# EAGLE design W5500_Tessera_002 (EAGLE 6.5.0)
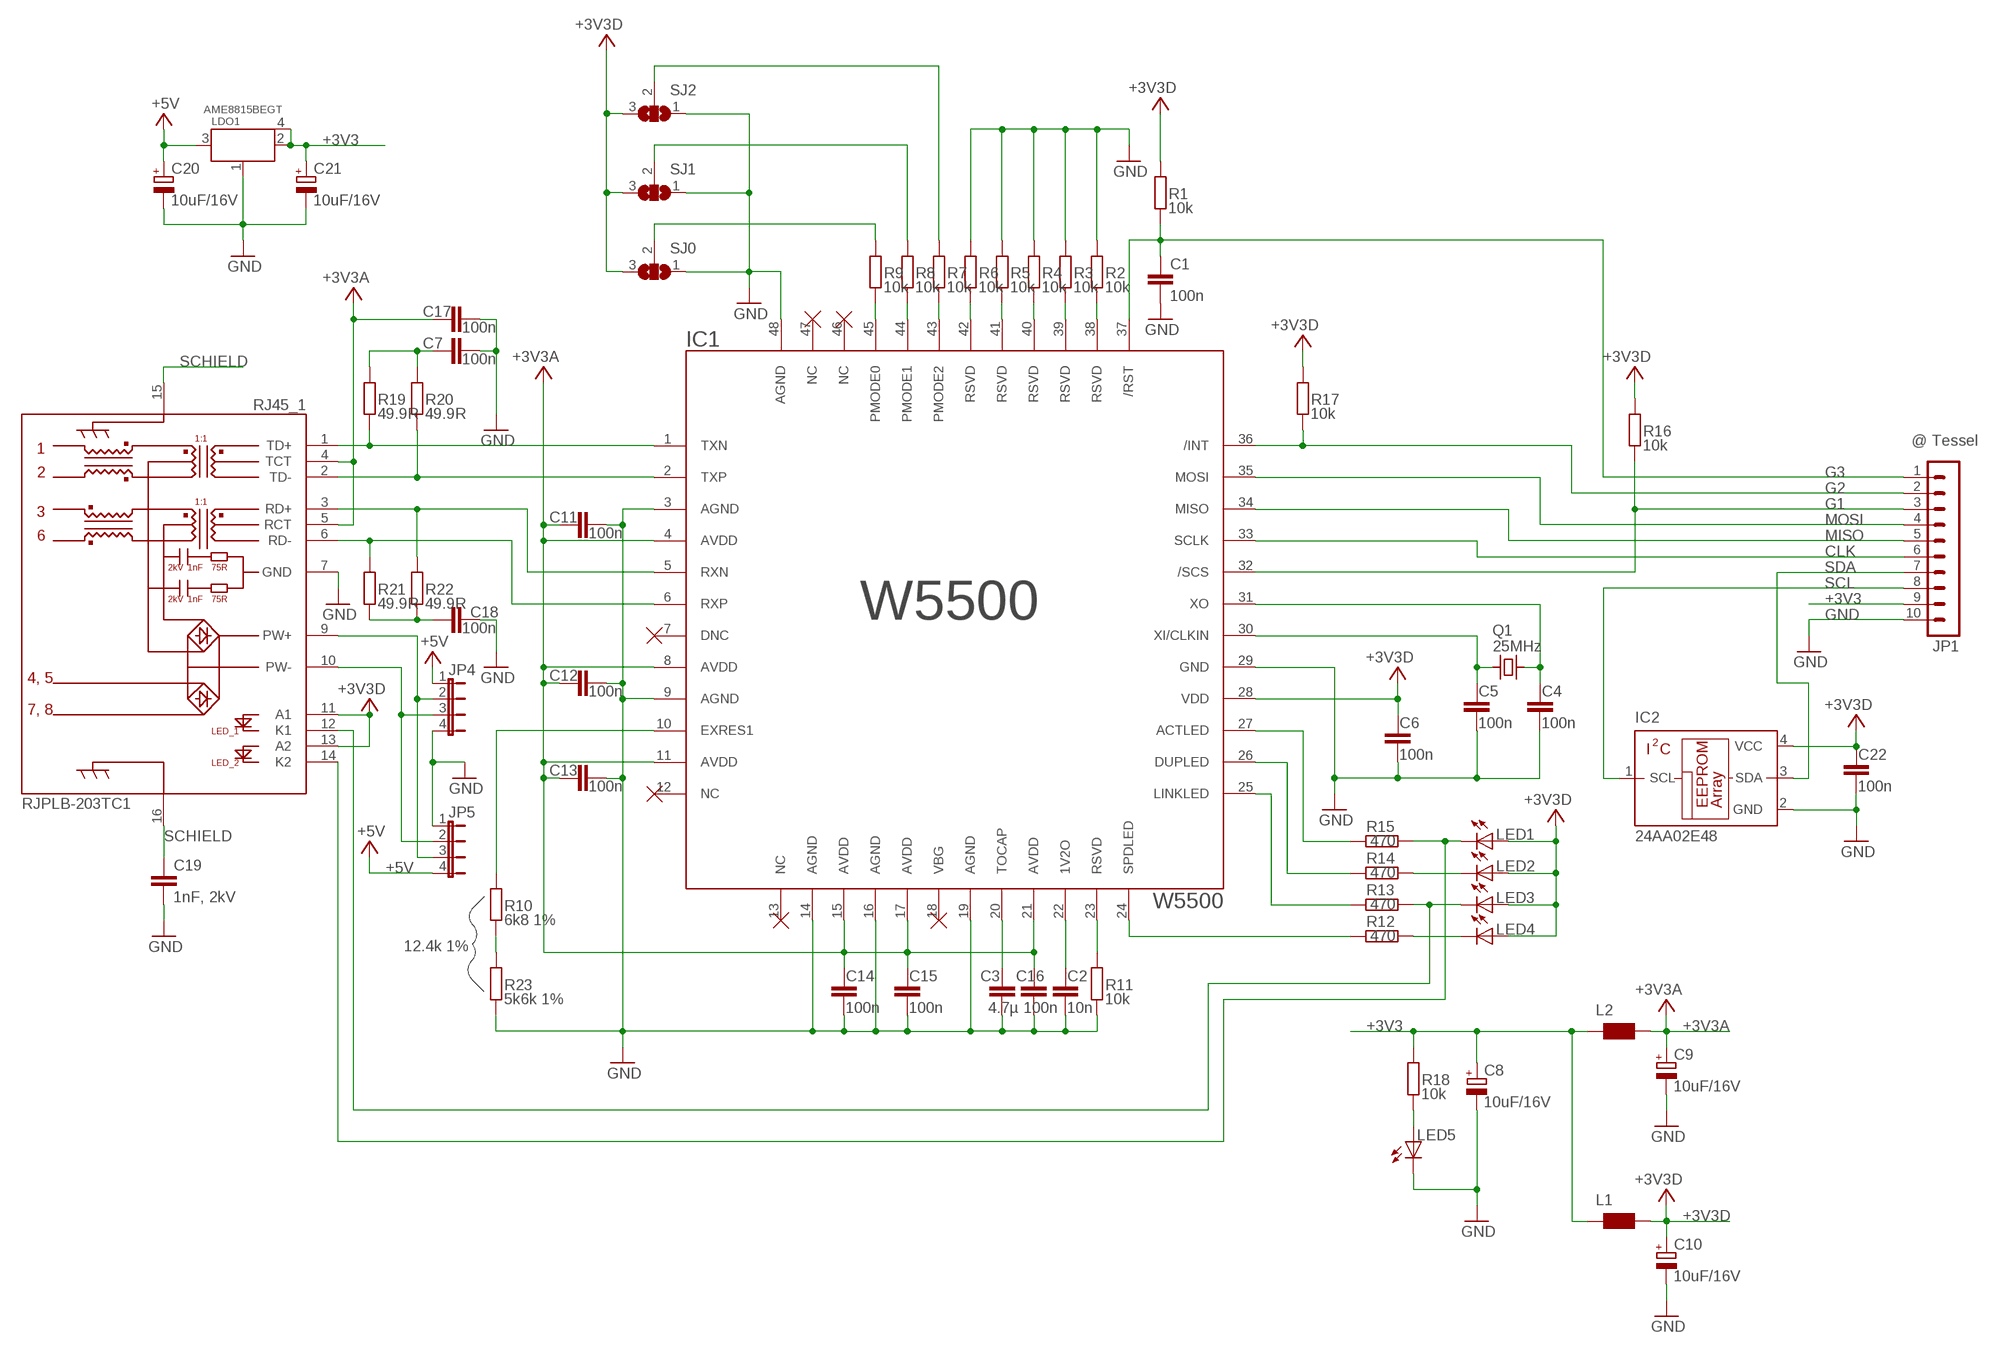
[diagram p0: schematic, sheet 1]

## Parts
C1  100n  C-EUC0603K  [C0603K]
C2  10n  C-EUC0402K  [C0402K]
C3  4.7µ  C-EUC2012  [C2012]
C4  100n  C-EUC0402K  [C0402K]
C5  100n  C-EUC0402K  [C0402K]
C6  100n  C-EUC0402K  [C0402K]
C7  100n  C-EUC0402K  [C0402K]
C8  10uF/16V  CPOL-EUA/3216-18W  [A/3216-18W]
C9  10uF/16V  CPOL-EUA/3216-18W  [A/3216-18W]
C10  10uF/16V  CPOL-EUA/3216-18W  [A/3216-18W]
C11  100n  C-EUC0402K  [C0402K]
C12  100n  C-EUC0402K  [C0402K]
C13  100n  C-EUC0402K  [C0402K]
C14  100n  C-EUC0402K  [C0402K]
C15  100n  C-EUC0402K  [C0402K]
C16  100n  C-EUC0402K  [C0402K]
C17  100n  C-EUC0402K  [C0402K]
C18  100n  C-EUC0402K  [C0402K]
C19  1nF, 2kV  C-EUC3216  [C3216]
C20  10uF/16V  CPOL-EUA/3216-18W  [A/3216-18W]
C21  10uF/16V  CPOL-EUA/3216-18W  [A/3216-18W]
C22  100n  C-EUC0402K  [C0402K]
IC1  W5500  [LQFP48]
IC2  24AA02E48  24AA00OT  [SOT23-5L]
JP1  @ Tessel  MA10-1  [MA10-1]
JP4  JP4E  [JP4]
JP5  JP4E  [JP4]
L1  WE-CBF_0603  [0603]
L2  WE-CBF_0603  [0603]
LDO1  AME8815BEGT  [SOT223]
LED1  LEDCHIPLED_0603  [CHIPLED_0603]
LED2  LEDCHIPLED_0603  [CHIPLED_0603]
LED3  LEDCHIPLED_0603  [CHIPLED_0603]
LED4  LEDCHIPLED_0603  [CHIPLED_0603]
LED5  LEDCHIPLED_0603  [CHIPLED_0603]
Q1  25MHz  SMD02502-4  [SMD02502-4]
R1  10k  R-EU_R0402  [R0402]
R2  10k  R-EU_R0402  [R0402]
R3  10k  R-EU_R0402  [R0402]
R4  10k  R-EU_R0402  [R0402]
R5  10k  R-EU_R0402  [R0402]
R6  10k  R-EU_R0402  [R0402]
R7  10k  R-EU_R0402  [R0402]
R8  10k  R-EU_R0402  [R0402]
R9  10k  R-EU_R0402  [R0402]
R10  6k8 1%  R-EU_R0402  [R0402]
R11  10k  R-EU_R0402  [R0402]
R12  470  R-EU_R0402  [R0402]
R13  470  R-EU_R0402  [R0402]
R14  470  R-EU_R0402  [R0402]
R15  470  R-EU_R0402  [R0402]
R16  10k  R-EU_R0402  [R0402]
R17  10k  R-EU_R0402  [R0402]
R18  10k  R-EU_R0402  [R0402]
R19  49.9R  R-EU_R0402  [R0402]
R20  49.9R  R-EU_R0402  [R0402]
R21  49.9R  R-EU_R0402  [R0402]
R22  49.9R  R-EU_R0402  [R0402]
R23  5k6k 1%  R-EU_R0402  [R0402]
RJ45_1  RJPLB-203TC1  [RJPLB-203]
SJ0  SJ2W  [SJ_2]
SJ1  SJ2W  [SJ_2]
SJ2  SJ2W  [SJ_2]

## Nets
+3V3: C8.+ C21.+ JP1.9 L1.2 L2.2 LDO1.2 LDO1.4 R18.2 RJ45_1.11(A1) RJ45_1.13(A2) ; supply symbol labelled +3V3D
+3V3A: C9.+ C11.1 C12.1 C13.1 C14.1 C15.1 C16.1 C17.1 IC1.4(AVDD) IC1.8(AVDD) IC1.11(AVDD) IC1.15(AVDD) IC1.17(AVDD) IC1.21(AVDD) L2.1 RJ45_1.4(TCT) RJ45_1.5(RCT)
+3V3D: C6.1 C10.+ C22.1 IC1.28(VDD) IC2.4(VCC) L1.1 LED1.A LED2.A LED3.A LED4.A R1.2 R16.2 R17.2 SJ0.3 SJ1.3 SJ2.3
+5V: C20.+ JP4.1 JP5.4 LDO1.3
ACTLED: IC1.27(ACTLED) R15.1
CLK: IC1.33(SCLK) JP1.6
G1: IC1.32(/SCS) JP1.3 R16.1
G2: IC1.36(/INT) JP1.2 R17.1
G3: C1.1 IC1.37(/RST) JP1.1 R1.1
GND: C1.2 C2.2 C3.2 C4.2 C5.2 C6.2 C7.2 C8.- C9.- C10.- C11.2 C12.2 C13.2 C14.2 C15.2 C16.2 C17.2 C18.2 C19.2 C20.- C21.- C22.2 IC1.3(AGND) IC1.9(AGND) IC1.14(AGND) IC1.16(AGND) IC1.19(AGND) IC1.29(GND) IC1.48(AGND) IC2.2(GND) JP1.10 JP4.4 JP5.1 LDO1.1 LED5.C R2.2 R3.2 R4.2 R5.2 R6.2 R11.1 R23.1 RJ45_1.7(GND) SJ0.1 SJ1.1 SJ2.1
MISO: IC1.34(MISO) JP1.5
MOSI: IC1.35(MOSI) JP1.4
N$4: IC1.25(LINKLED) R13.1
N$5: R10.1 R23.2
N$9: IC1.23(RSVD) R11.2
N$10: IC1.38(RSVD) R2.1
N$11: IC1.39(RSVD) R3.1
N$12: IC1.40(RSVD) R4.1
N$13: IC1.41(RSVD) R5.1
N$14: IC1.42(RSVD) R6.1
N$15: IC1.43(PMODE2) R7.1
N$16: IC1.44(PMODE1) R8.1
N$17: IC1.45(PMODE0) R9.1
N$18: R9.2 SJ0.2
N$19: R8.2 SJ1.2
N$20: R7.2 SJ2.2
N$22: IC1.10(EXRES1) R10.2
N$23: C2.1 IC1.22(1V2O)
N$24: C3.1 IC1.20(TOCAP)
N$25: IC1.24(SPDLED) R12.1
N$26: IC1.26(DUPLED) R14.1
N$28: LED4.C R12.2
N$29: LED3.C R13.2 RJ45_1.12(K1)
N$30: LED2.C R14.2
N$31: LED1.C R15.2 RJ45_1.14(K2)
N$32: C4.1 IC1.31(XO) Q1.3
N$33: C5.1 IC1.30(XI/CLKIN) Q1.1
N$34: LED5.A R18.1
N$35: C7.1 R19.2 R20.2
N$36: C18.1 R21.1 R22.1
POE+: JP4.2 JP5.3 RJ45_1.9(PW+)
POE-: JP4.3 JP5.2 RJ45_1.10(PW-)
RXN: IC1.6(RXP) R21.2 RJ45_1.6(RD-)
RXP: IC1.5(RXN) R22.2 RJ45_1.3(RD+)
SCHIELD: C19.1 RJ45_1.15(SCHIELD_1) RJ45_1.16(SCHIELD_2)
SCL: IC2.1(SCL) JP1.8
SDA: IC2.3(SDA) JP1.7
TXN: IC1.2(TXP) R20.1 RJ45_1.2(TD-)
TXP: IC1.1(TXN) R19.1 RJ45_1.1(TD+)
Unconnected: IC1.7(DNC) IC1.12(NC) IC1.13(NC) IC1.18(VBG) IC1.46(NC) IC1.47(NC)

## Notes on the sheet
- W5500
- 12.4k 1%

## Library data of the parts
C1-C7 C11-C19 C22 = resistor:C-EU: CAPACITOR, European symbol
C8-C10 C20 C21 = resistor:CPOL-EU: POLARIZED CAPACITOR, European symbol
IC1 = _wiznet_2013-08-18:W5500: W5500: WIZnet Hardwired TCP/IP + MAC + PHY - Internet Interface Chip
IC2 = microchip:24*00: Serial EEPROM 128 bit, I2C (AA = 1.8 V/LC = 2.5 V/C = 5.0 V); MF: MICROCHIP; MPN: 24AA00T-I/OTG; OC_FARNELL: 1331264; OC_NEWARK: 89H3038
JP1 = con-lstb:MA10-1: PIN HEADER; OC_FARNELL: unknown; OC_NEWARK: unknown
JP4 JP5 = jumper:JP4E: JUMPER
L1 L2 = wuerth-elektronik:WE-CBF: SMD EMI Suppression Ferrite Beads - excellent anti-EMI properties - low DCR - impedances till 3000 ohms - rated current up to 6 A
LDO1 = _wiznet_2013-08-18:AME8815BEGT
LED1-LED5 = led:LED: LED OSRAM: - CHIPLED LG R971, LG N971, LY N971, LG Q971, LY Q971, LO R971, LY R971 LH N974, LH R974 LS Q976, LO Q976, LY Q976 LO Q996 - Hyper CHIPLED LW Q18S LB Q993, LB Q99A, LB R99A - SideLED LS A670, LO A670, LY A670, LG A670, LP A670 LB A673, LV A673, LT A673, LW A673 LH A674 LY A675 LS A676, LA A676, LO A676, LY A676, LW A676 LS A679, LY A679, LG A679 - Hyper Micro SIDELED® LS Y876, LA Y876, LO Y876, LY Y876 LT Y87S - SmartLED LW L88C, LW L88S LB L89C, LB L89S, LG L890 LS L89K, LO L89K, LY L89K LS L896, LA L896, LO L896, LY L896 - TOPLED LS T670, LO T670, LY T670, LG T670, LP T670 LSG T670, LSP T670, LSY T670, LOP T670, LYG T670 LG T671, LOG T671, LSG T671 LB T673, LV T673, LT T673, LW T673 LH T674 LS T676, LA T676, LO T676, LY T676, LB T676, LH T676, LSB T676, LW T676 LB T67C, LV T67C, LT T67C, LS T67K, LO T67K, LY T67K, LW E67C LS E67B, LA E67B, LO E67B, LY E67B, LB E67C, LV E67C, LT E67C LW T67C LS T679, LY T679, LG T679 LS T770, LO T770, LY T770, LG T770, LP T770 LB T773, LV T773, LT T773, LW T773 LH T774 LS E675, LA E675, LY E675, LS T675 LS T776, LA T776, LO T776, LY T776, LB T776 LHGB T686 LT T68C, LB T68C - Hyper Mini TOPLED® LB M676 - Mini TOPLED Santana® LG M470 LS M47K, LO M47K, LY M47K Source: http://www.osram.convergy.de LUXEON: - LUMILED® LXK2-PW12-R00, LXK2-PW12-S00, LXK2-PW14-U00, LXK2-PW14-V00 LXK2-PM12-R00, LXK2-PM12-S00, LXK2-PM14-U00 LXK2-PE12-Q00, LXK2-PE12-R00, LXK2-PE12-S00, LXK2-PE14-T00, LXK2-PE14-U00 LXK2-PB12-K00, LXK2-PB12-L00, LXK2-PB12-M00, LXK2-PB14-N00, LXK2-PB14-P00, LXK2-PB14-Q00 LXK2-PR12-L00, LXK2-PR12-M00, LXK2-PR14-Q00, LXK2-PR14-R00 LXK2-PD12-Q00, LXK2-PD12-R00, LXK2-PD12-S00 LXK2-PH12-R00, LXK2-PH12-S00 LXK2-PL12-P00, LXK2-PL12-Q00, LXK2-PL12-R00 Source: www.luxeon.com KINGBRIGHT: KA-3528ASYC Source: www.kingbright.com
Q1 = Petermann_5_11_0:SMD02502-4
R1-R23 = resistor:R-EU_: RESISTOR, European symbol
RJ45_1 = Taimag:RJPLB-203TC1
SJ0 SJ1 SJ2 = jumper:SJ2W: SMD solder JUMPER

## Board
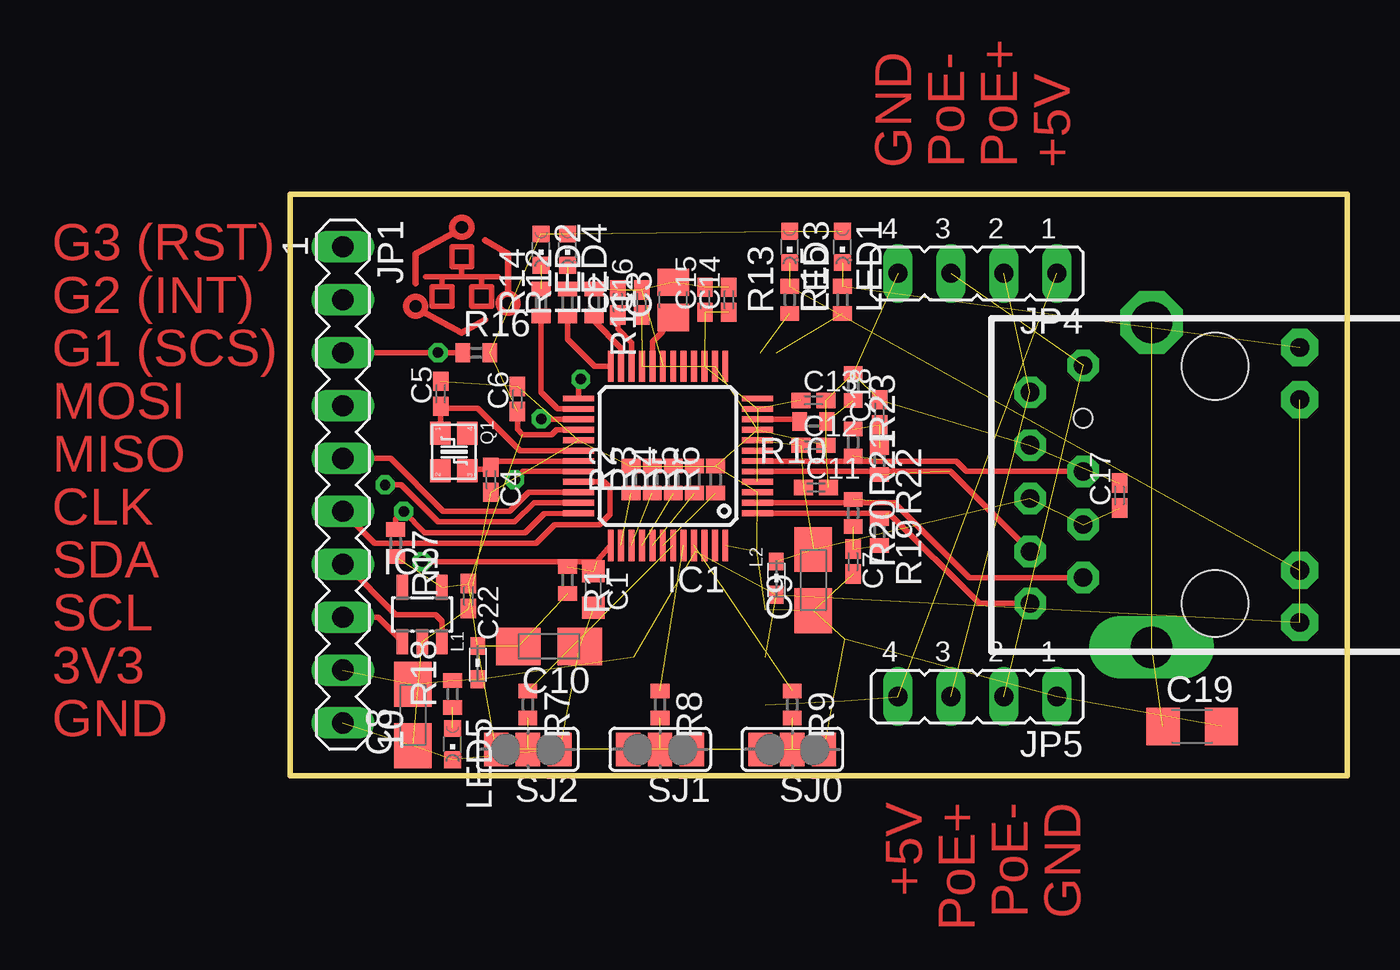
[diagram p1: board, top side]
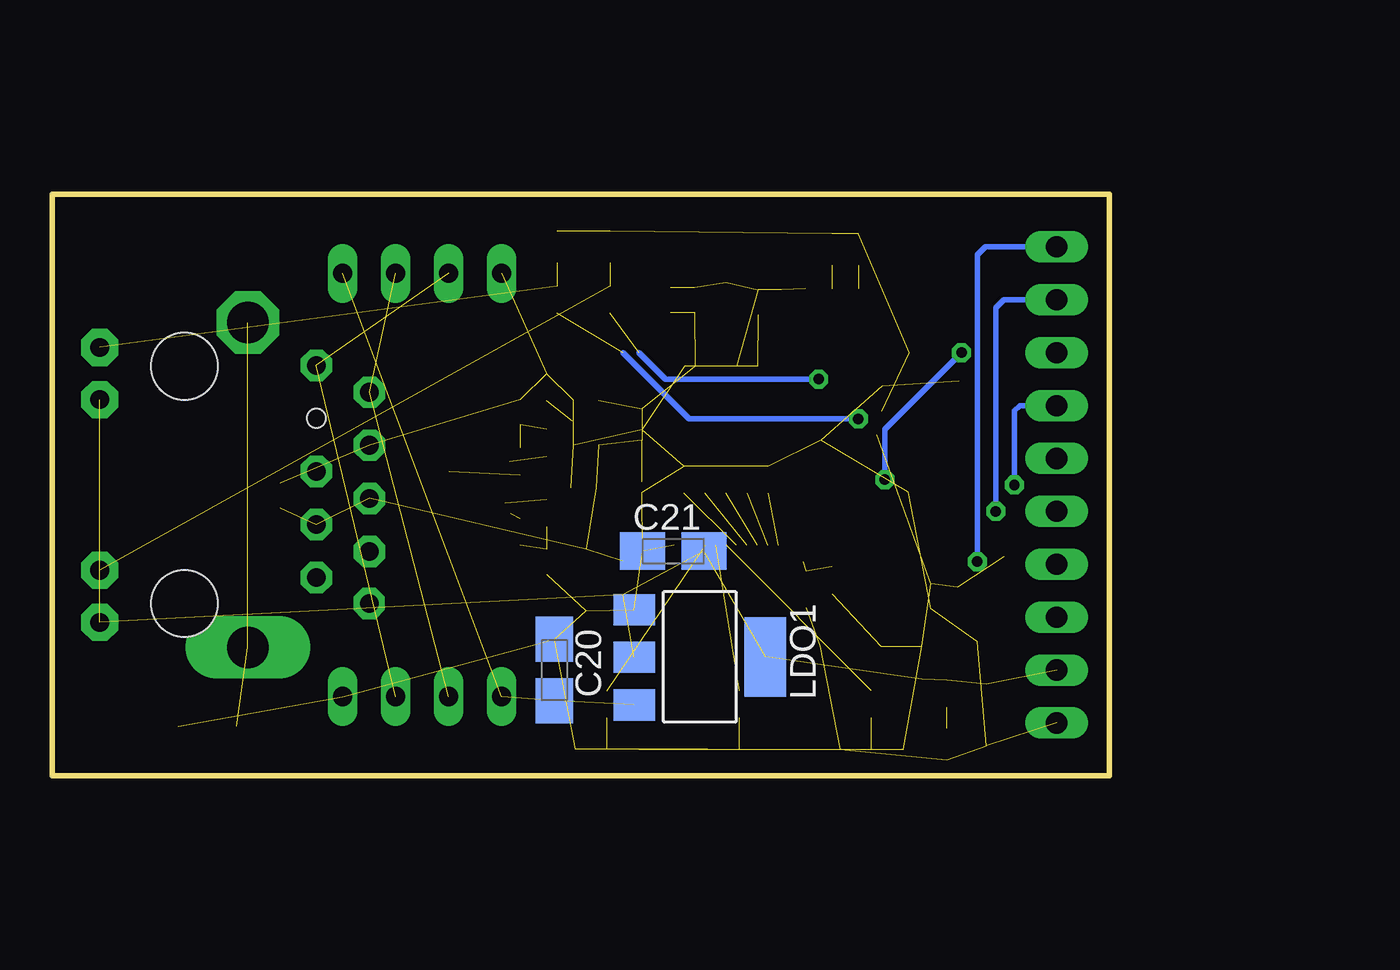
[diagram p2: board, bottom side, seen from below]

Size 50.8 x 27.94 mm. Coordinates in mm from the lower left corner, seen from the top.
Outline: 0,0 50.8,0 50.8,27.94 0,27.93 0,0
Copper layers (1*16): Top 0.035mm / dielectric 1.5mm / Bottom 0.035mm
Design rules "default": minimum track width 10mil, minimum drill 24mil, track to track 8mil, track to pad 8mil, pad to pad 8mil, via to via 8mil, smd to smd 8mil, copper to edge 40mil, drill to drill 8mil, minimum pad ring 10mil, minimum via ring 8mil, stop-mask expansion 4mil, vias tented up to drill 0mil, thermal gap 10mil

### Footprints (pad centres in the part's own frame; a part is rotated, then mirrored left to right if it is on the bottom)
C0603K = smd 1.05 x 1.08: 1 -0.875,0; 2 0.875,0
C0402K = smd 0.925 x 0.74: 1 -0.6,0; 2 0.6,0
C2012 = smd 1.3 x 1.5: 1 -0.85,0; 2 0.85,0
A/3216-18W = smd 2.15 x 1.8: + 1.475,0; - -1.475,0
C3216 = smd 1.6 x 1.8: 1 -1.4,0; 2 1.4,0
LQFP48 = smd 1.5 x 0.28: 1 -4.3,2.75; 2 -4.3,2.25; 3 -4.3,1.75; 4 -4.3,1.25; 5 -4.3,0.75; 6 -4.3,0.25; 7 -4.3,-0.25; 8 -4.3,-0.75; 9 -4.3,-1.25; 10 -4.3,-1.75; 11 -4.3,-2.25; 12 -4.3,-2.75; 25 4.3,-2.75; 26 4.3,-2.25; 27 4.3,-1.75; 28 4.3,-1.25; 29 4.3,-0.75; 30 4.3,-0.25; 31 4.3,0.25; 32 4.3,0.75; 33 4.3,1.25; 34 4.3,1.75; 35 4.3,2.25; 36 4.3,2.75 | smd 0.28 x 1.5: 13 -2.75,-4.3; 14 -2.25,-4.3; 15 -1.75,-4.3; 16 -1.25,-4.3; 17 -0.75,-4.3; 18 -0.25,-4.3; 19 0.25,-4.3; 20 0.75,-4.3; 21 1.25,-4.3; 22 1.75,-4.3; 23 2.25,-4.3; 24 2.75,-4.3; 37 2.75,4.3; 38 2.25,4.3; 39 1.75,4.3; 40 1.25,4.3; 41 0.75,4.3; 42 0.25,4.3; 43 -0.25,4.3; 44 -0.75,4.3; 45 -1.25,4.3; 46 -1.75,4.3; 47 -2.25,4.3; 48 -2.75,4.3
SOT23-5L = smd 0.55 x 1.2: 1 -0.95,-1.3; 2 0,-1.3; 3 0.95,-1.3; 4 0.95,1.3; 5 -0.95,1.3
MA10-1 = drill 1.016 long: 1 -11.43,0; 2 -8.89,0; 3 -6.35,0; 4 -3.81,0; 5 -1.27,0; 6 1.27,0; 7 3.81,0; 8 6.35,0; 9 8.89,0; 10 11.43,0
JP4 = drill 0.914 long: 1 -3.81,0; 2 -1.27,0; 3 1.27,0; 4 3.81,0
0603 = smd 0.85 x 0.7: 1 -0.9,0; 2 0.7,0
SOT223 = smd 1.499 x 2.007: 1 -2.261,-3.15; 2 0.025,-3.15; 3 2.311,-3.15 | smd 3.81 x 2.007: 4 0,3.15
CHIPLED_0603 = smd 0.8 x 0.8: A 0,-0.75; C 0,0.75
SMD02502-4 = smd 1.1 x 1: 1 -0.9,-0.65; 2 0.9,-0.65; 3 0.9,0.65; 4 -0.9,0.65
R0402 = smd 0.7 x 0.9: 1 -0.65,0; 2 0.65,0
RJPLB-203 = drill 0.9 pad 1.5 octagon: 1 -5.69,8.888; 2 -4.45,6.348; 3 -3.2,8.898; 4 -1.9,6.348; 5 -0.65,8.898; 6 0.65,6.348; 7 1.9,8.898; 9 4.45,8.898; 10 5.74,6.348 | drill 0.9 pad 1.778 octagon: 11 -6.6,-4.062; 12 -4.1,-4.062; 13 4.1,-4.062; 14 6.6,-4.062 | drill 2 pad 2.2 long: 15 -7.8,3.058 | drill 2 pad 3 octagon: 16 7.8,3.058 | hole 3.2: 5.7,0.008; -5.7,0.008 | hole 0.9: 3.2,6.35
SJ_2 = smd 1.168 x 1.6: 1 -1.524,0; 2 0,0; 3 1.524,0

### Placement (x,y rotation side)
C1  14.57,8.95 270 top
C2  15.75,22.73 90 top
C3  18.41,22.86 90 top
C4  9.65,14.22 270 top
C5  7.24,18.35 90 top
C6  10.92,18.1 90 top
C7  27.05,10.29 270 top
C8  5.91,2.92 90 top
C9  25.15,9.4 90 top
C10  12.45,6.22 180 top
C11  25.27,13.84 0 top
C12  25.15,15.88 0 top
C13  25.15,18.03 0 top
C14  21.08,22.86 90 top
C15  19.94,22.86 90 top
C16  16.89,22.73 90 top
C17  39.85,13.46 90 top
C18  28.32,17.46 90 top
C19  43.34,2.38 0 top
C20  26.67,5.08 270 bottom
C21  20.95,10.79 0 bottom
C22  8.57,8.64 270 top
IC1  18.16,15.37 180 top
IC2  6.35,7.75 0 top
JP1  2.54,13.97 270 top
JP4  33.02,24.13 180 top
JP5  33.02,3.81 180 top
L1  9.02,5.33 270 top
L2  23.37,9.4 270 top
LDO1  19.68,5.71 270 bottom
LED1  26.54,25.4 180 top
LED2  12.06,25.27 180 top
LED3  24,25.4 180 top
LED4  13.34,25.27 180 top
LED5  7.81,1.52 180 top
Q1  7.87,15.56 270 top
R1  13.34,9.4 270 top
R2  16.38,14.22 90 top
R3  17.4,14.22 90 top
R4  18.41,14.22 90 top
R5  19.43,14.22 90 top
R6  20.45,14.22 90 top
R7  11.43,3.43 270 top
R8  17.78,3.43 270 top
R9  24.13,3.43 270 top
R10  25.15,17.02 180 top
R11  14.61,22.73 270 top
R12  13.34,22.73 90 top
R13  24,22.86 90 top
R14  12.06,22.73 90 top
R15  26.54,22.86 90 top
R16  8.95,20.32 0 top
R17  5.08,11.18 270 top
R18  7.81,3.94 90 top
R19  28.32,11.72 270 top
R20  27.05,12.62 270 top
R21  27.05,16 270 top
R22  28.32,15.11 270 top
R23  27.05,18.67 270 top
RJ45_1  44.45,13.97 90 top
SJ0  24.13,1.27 180 top
SJ1  17.78,1.27 180 top
SJ2  11.43,1.27 180 top

### Tracks (layer width: path | path; a pad name or v marks a point on that pad's centre or on a via)
+3V3  (9 unrouted)
+3V3A  (16 unrouted)
+3V3D  (14 unrouted)
  Top 0.254: IC1.28 12.81,16.62 12.57,16.38 11.18,16.38 10.92,16.64 C6.1
+5V  (3 unrouted)
ACTLED  (via drill 0.5 pad 0.25)  (1 unrouted)
  Top 0.254: IC1.27 12.09,17.12 v12.06,17.14
  Bottom 0.254: v12.06,17.14 20.19,17.14 23.37,20.32
CLK
  Top 0.254: IC1.33 15.09,14.12 15.37,13.84 15.37,12.57 14.86,12.06 12.7,12.06 11.81,11.18 4.06,11.18 JP1.6
G1  (via drill 0.5 pad 0.25)
  Top 0.254: IC1.32 11.19,14.62 v10.79,14.22 | JP1.3 v7.11,20.32 R16.1
  Bottom 0.254: v10.79,14.22 10.79,16.64 v7.11,20.32
G2  (via drill 0.5 pad 0.25)
  Top 0.254: IC1.36 12.21,12.59 11.3,11.68 6.48,11.68 v5.46,12.7 5.08,12.32 R17.1
  Bottom 0.254: JP1.2 5.08,22.86 5.46,22.48 v5.46,12.7
G3  (via drill 0.5 pad 0.25)  (2 unrouted)
  Top 0.254: IC1.37 14.73,10.29 v6.35,10.29
  Bottom 0.254: JP1.1 5.97,25.4 6.35,25.02 v6.35,10.29
GND  (45 unrouted)
MISO
  Top 0.254: IC1.34 11.46,13.62 10.54,12.7 7.37,12.7 4.83,15.24 JP1.5
MOSI  (via drill 0.5 pad 0.25)
  Top 0.254: IC1.35 11.72,13.12 10.79,12.19 7.11,12.19 5.33,13.97 v4.57,13.97
  Bottom 0.254: JP1.4 4.32,17.78 4.57,17.53 v4.57,13.97
N$1
  Top 0.305: 7.78,26.04 6.03,25.08 6.03,23.65
N$2
  Top 0.305: 6.51,22.23 8.26,21.27 9.37,21.91
N$3
  Top 0.305: 10.48,23.18 10.48,25.08 9.37,25.72
N$4  (via drill 0.5 pad 0.25)  (1 unrouted)
  Top 0.254: IC1.25 13.86,18.94 v13.97,19.05
  Bottom 0.254: v13.97,19.05 21.34,19.05 22.61,20.32
N$5  (1 unrouted)
N$8
  Top 0.254: 6.51,23.97 7.3,23.97 | 7.3,23.97 8.26,23.97 | 8.26,23.97 9.21,23.97 | 9.21,23.97 10,23.97 | 8.26,23.97 8.26,24.45 | 8.26,24.45 7.78,24.45 7.78,25.4 8.73,25.4 8.73,24.45 8.26,24.45 | 9.21,23.97 9.21,23.5 | 9.21,23.5 9.68,23.5 9.68,22.54 8.73,22.54 8.73,23.5 9.21,23.5 | 7.3,23.97 7.3,23.5 | 7.3,23.5 7.78,23.5 7.78,22.54 6.83,22.54 6.83,23.5 7.3,23.5
N$9
  Top 0.254: IC1.23 15.91,20.54 14.61,21.84 R11.2
N$10  (1 unrouted)
N$11  (1 unrouted)
N$12  (1 unrouted)
N$13  (1 unrouted)
N$14  (1 unrouted)
N$15  (1 unrouted)
N$16  (1 unrouted)
N$17  (1 unrouted)
N$18  (1 unrouted)
N$19  (1 unrouted)
N$20  (1 unrouted)
N$22
  Top 0.254: IC1.10 24.4,17.12 R10.2
N$23
  Top 0.254: IC1.22 16.41,20.8 15.75,21.46 C2.1
N$24
  Top 0.254: IC1.20 17.41,20.84 17.91,21.34 17.91,21.5 C3.1
N$25
  Top 0.254: IC1.24 14.62,19.67 13.34,20.95 R12.1
N$26
  Top 0.254: IC1.26 12.86,17.62 12.06,18.41 R14.1
N$28  (1 unrouted)
N$29  (2 unrouted)
N$30  (1 unrouted)
N$31  (2 unrouted)
N$32
  Top 0.254: IC1.31 13.85,15.12 12.06,15.11 9.74,15.11 C4.1 9.56,14.89 9.4,14.73 8.6,14.73 Q1.3
N$33
  Top 0.254: Q1.1 7.22,17.61 C5.1 7.34,17.65 9.02,17.65 11.05,15.62 IC1.30
N$34  (1 unrouted)
N$35  (2 unrouted)
N$36  (2 unrouted)
POE+  (2 unrouted)
POE-  (2 unrouted)
RXN  (1 unrouted)
  Top 0.254: IC1.6 28.83,15.11 32,15.11 32.5,14.62 RJ45_1.6
RXP  (1 unrouted)
  Top 0.254: IC1.5 31.74,14.62 35.59,10.77 RJ45_1.3
SCHIELD  (2 unrouted)
SCL
  Top 0.254: JP1.8 4.23,7.62 IC2.1
SDA
  Top 0.254: JP1.7 2.67,10.16 5.08,7.75 6.99,7.75 7.3,7.43 IC2.3
TXN  (1 unrouted)
  Top 0.254: IC1.2 29.05,13.12 32.64,9.52 RJ45_1.2
TXP  (1 unrouted)
  Top 0.254: IC1.1 28.79,12.62 33.12,8.28 RJ45_1.1
(copper drawn outside any net)
  shapes: Top circle x3

### Text on the board
Top: W5500 - Tessel Module = WIZnet-Internet-Tessera | GND | PoE- | PoE+ | +5V | G3 (RST) | G2 (INT) | G1 (SCS) | MOSI | MISO | CLK | SDA | SCL | 3V3 | GND | +5V | PoE+ | PoE- | GND
Document: PoE out #2 | GPIOs | SPI | Ethernet / + PoE | I²C | Power | PoE out #1